# EAGLE design GSMGPSShield (EAGLE 6.3)
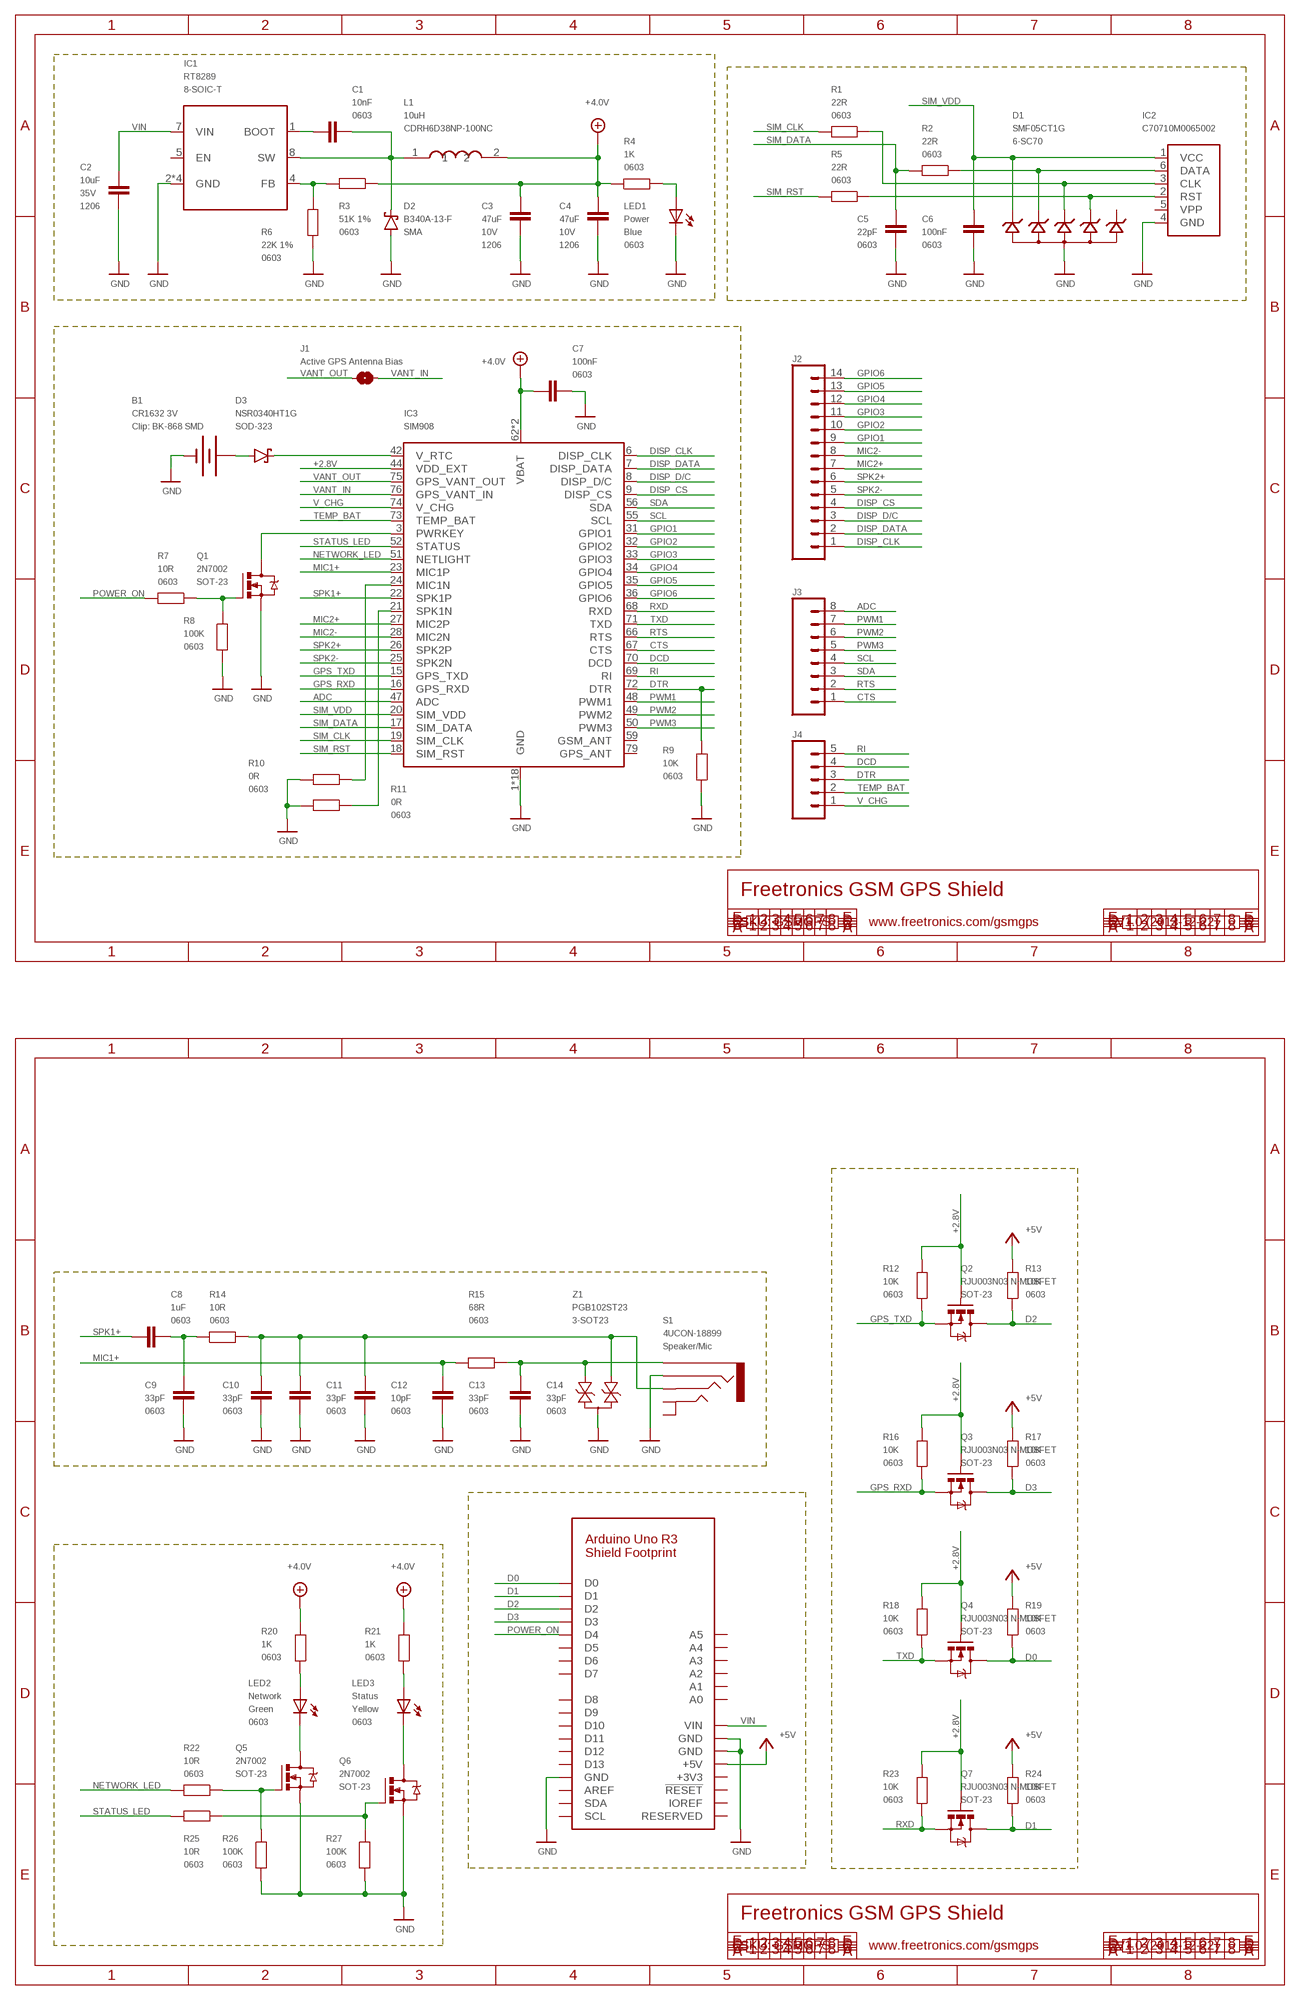
[diagram p0: schematic, sheet 1]

## Parts
B1  CR1632 3V  BATTERY  [BATCON_16MM]
C1  10nF  CAP0603  [0603]
C2  10uF  C-EUC1206  [C1206]
C3  47uF  C-EUC1206  [C1206]
C4  47uF  C-EUC1206  [C1206]
C5  22pF  CAP0603  [0603]
C6  100nF  CAP0603  [0603]
C7  100nF  CAP0603  [0603]
C8  1uF  CAP0603  [0603]
C9  33pF  CAP0603  [0603]
C10  33pF  CAP0603  [0603]
C11  33pF  CAP0603  [0603]
C12  10pF  CAP0603  [0603]
C13  33pF  CAP0603  [0603]
C14  33pF  CAP0603  [0603]
D1  SMF05CT1G  [SC70-6]
D2  B340A-13-F  SCHOTTKY-SMA  [SMA]
D3  NSR0340HT1G  SCHOTTKY-SOD323  [SOD-323]
IC1  RT8289  [SO08T]
IC2  C70710M0065002  [C70710M0065002]
IC3  SIM908  [SIM908]
J1  Active GPS Antenna Bias  SJ  [SJ]
J2  M14  [1X14]
J3  M08STD  [1X08]
J4  M05PTH  [1X05]
J5  ARDUINO-SHIELD_R3_NOISP  [ARDUINO-SHIELD_R3_NOISP]
L1  10uH  CDRH6D38SMT  [CDRH]
LED1  Power  LED0603  [LED-0603]
LED2  Network  LED0603  [LED-0603]
LED3  Status  LED0603  [LED-0603]
Q1  2N7002  [SOT23-3]
Q2  RJU003N03 N-MOSFET  MOSFET-NSOT-323  [SOT32-3]
Q3  RJU003N03 N-MOSFET  MOSFET-NSOT-323  [SOT32-3]
Q4  RJU003N03 N-MOSFET  MOSFET-NSOT-323  [SOT32-3]
Q5  2N7002  [SOT23-3]
Q6  2N7002  [SOT23-3]
Q7  RJU003N03 N-MOSFET  MOSFET-NSOT-323  [SOT32-3]
R1  22R  RESISTOR0603  [0603]
R2  22R  RESISTOR0603  [0603]
R3  51K 1%  RESISTOR0603  [0603]
R4  1K  RESISTOR0603  [0603]
R5  22R  RESISTOR0603  [0603]
R6  22K 1%  RESISTOR0603  [0603]
R7  10R  RESISTOR0603  [0603]
R8  100K  RESISTOR0603  [0603]
R9  10K  RESISTOR0603  [0603]
R10  0R  RESISTOR0603  [0603]
R11  0R  RESISTOR0603  [0603]
R12  10K  RESISTOR0603  [0603]
R13  10K  RESISTOR0603  [0603]
R14  10R  RESISTOR0603  [0603]
R15  68R  RESISTOR0603  [0603]
R16  10K  RESISTOR0603  [0603]
R17  10K  RESISTOR0603  [0603]
R18  10K  RESISTOR0603  [0603]
R19  10K  RESISTOR0603  [0603]
R20  1K  RESISTOR0603  [0603]
R21  1K  RESISTOR0603  [0603]
R22  10R  RESISTOR0603  [0603]
R23  10K  RESISTOR0603  [0603]
R24  10K  RESISTOR0603  [0603]
R25  10R  RESISTOR0603  [0603]
R26  100K  RESISTOR0603  [0603]
R27  100K  RESISTOR0603  [0603]
S1  4UCON-18899  AUDIO-JACK-4POLE  [4UCON-18899]
Z1  PGB102ST23  [SOT23-3]

## Nets
+2.8V: IC3.44(VDD_EXT) Q2.1(G) Q3.1(G) Q4.1(G) Q7.1(G) R12.1 R16.1 R18.1 R23.1
+4.0V: C3.1 C4.1 C7.2 IC3.62(VBAT) IC3.63(VBAT) L1.2 R3.1 R4.1 R20.1 R21.1
+5V: J5.+5V R13.1 R17.1 R19.1 R24.1
ADC: IC3.47(ADC) J3.8
CTS: IC3.67(CTS) J3.1
D0: J5.D0 Q4.3(D) R19.2
D1: J5.D1 Q7.3(D) R24.2
D2: J5.D2 Q2.3(D) R13.2
D3: J5.D3 Q3.3(D) R17.2
DCD: IC3.70(DCD) J4.4
DISP_CLK: IC3.6(DISP_CLK) J2.1
DISP_CS: IC3.9(DISP_CS) J2.4
DISP_D/C: IC3.8(DISP_D/C) J2.3
DISP_DATA: IC3.7(DISP_DATA) J2.2
DTR: IC3.72(DTR) J4.3 R9.1
GND: B1.GND(-) C2.2 C3.2 C4.2 C5.1 C6.1 C7.1 C9.1 C10.1 C11.1 C12.1 C13.1 C14.1 D1.2(A2) D2.A IC1.2(GND) IC1.3(GND) IC1.6(GND) IC1.PAD(GND) IC2.4(GND) IC3.1(GND) IC3.2(GND) IC3.5(GND) IC3.10(GND) IC3.14(GND) IC3.37(GND) IC3.40(GND) IC3.41(GND) IC3.43(GND) IC3.57(GND) IC3.58(GND) IC3.60(GND) IC3.61(GND) IC3.64(GND) IC3.65(GND) IC3.77(GND) IC3.78(GND) IC3.80(GND) J5.GND J5.GND@0(GND) J5.GND@1(GND) LED1.C Q1.2(S) Q5.2(S) Q6.2(S) R6.1 R8.1 R9.2 R10.2 R11.2 R26.1 R27.1 S1.4 Z1.3
GPIO1: IC3.31(GPIO1) J2.9
GPIO2: IC3.32(GPIO2) J2.10
GPIO3: IC3.33(GPIO3) J2.11
GPIO4: IC3.34(GPIO4) J2.12
GPIO5: IC3.35(GPIO5) J2.13
GPIO6: IC3.36(GPIO6) J2.14
GPS_RXD: IC3.16(GPS_RXD) Q3.2(S) R16.2
GPS_TXD: IC3.15(GPS_TXD) Q2.2(S) R12.2
MIC1+: C13.2 IC3.23(MIC1P) R15.1
MIC2+: IC3.27(MIC2P) J2.7
MIC2-: IC3.28(MIC2N) J2.8
N$1: LED1.A R4.2
N$2: LED2.C Q5.3(D)
N$3: LED3.C Q6.3(D)
N$4: Q5.1(G) R22.1 R26.2
N$5: Q6.1(G) R25.1 R27.2
N$7: D3.K IC3.42(V_RTC)
N$8: IC3.3(PWRKEY) Q1.3(D)
N$9: B1.PWR@1(+) D3.A
N$10: IC3.21(SPK1N) R11.1
N$11: IC3.24(MIC1N) R10.1
N$12: D1.5(K5) IC2.2(RST) R5.1
N$13: D1.4(K4) IC2.3(CLK) R1.1
N$15: D1.3(K3) IC2.6(DATA) R2.1
N$16: C14.2 R15.2 S1.1 Z1.2
N$17: C10.2 C11.2 C12.2 R14.2 S1.3 Z1.1
N$20: C8.1 C9.2 R14.1
N$34: Q1.1(G) R7.1 R8.2
N$76: LED3.A R21.2
N$77: LED2.A R20.2
N$143: C1.1 D2.K IC1.8(SW) L1.1
N$144: IC1.4(FB) R3.2 R6.2
N$145: C1.2 IC1.1(BOOT)
NETWORK_LED: IC3.51(NETLIGHT) R22.2
POWER_ON: J5.D4 R7.2
PWM1: IC3.48(PWM1) J3.7
PWM2: IC3.49(PWM2) J3.6
PWM3: IC3.50(PWM3) J3.5
RI: IC3.69(RI) J4.5
RTS: IC3.66(RTS) J3.2
RXD: IC3.68(RXD) Q7.2(S) R23.2
SCL: IC3.55(SCL) J3.4
SDA: IC3.56(SDA) J3.3
SIM_CLK: IC3.19(SIM_CLK) R1.2
SIM_DATA: C5.2 IC3.17(SIM_DATA) R2.2
SIM_RST: IC3.18(SIM_RST) R5.2
SIM_VDD: C6.2 D1.1(K1) IC2.1(VCC) IC3.20(SIM_VDD)
SPK1+: C8.2 IC3.22(SPK1P)
SPK2+: IC3.26(SPK2P) J2.6
SPK2-: IC3.25(SPK2N) J2.5
STATUS_LED: IC3.52(STATUS) R25.2
TEMP_BAT: IC3.73(TEMP_BAT) J4.2
TXD: IC3.71(TXD) Q4.2(S) R18.2
V_CHG: IC3.74(V_CHG) J4.1
VANT_IN: IC3.76(GPS_VANT_IN) J1.2
VANT_OUT: IC3.75(GPS_VANT_OUT) J1.1
VIN: C2.1 IC1.7(VIN) J5.VIN
Unconnected: D1.6(K6) IC1.5(EN) IC2.5(VPP) IC3.59(GSM_ANT) IC3.79(GPS_ANT) J5.!RESET J5.A0 J5.A1 J5.A2 J5.A3 J5.A4 J5.A5 J5.AREF J5.D5 J5.D6 J5.D7 J5.D8 J5.D9 J5.D10 J5.D11 J5.D12 J5.D13 J5.IOREF J5.RESERVED J5.SCL J5.SDA S1.2A S1.2B

## Notes on the sheet
- Freetronics GSM GPS Shield
- SKU: GSMGPS | www.freetronics.com/gsmgps | V1.0 (2013-12-22)
- Freetronics GSM GPS Shield
- SKU: GSMGPS | www.freetronics.com/gsmgps | V1.0 (2013-12-22)

## Power pins joined to a net without a drawn wire
+3V3: J5.3V3(+3V3)

## Library data of the parts
B1 = freetronics-master-v1:BATTERY: Battery Holders Various common sizes : AA, AAA, 20mm coin cell and 12mm coin cell.; FOO: Clip: BK-868 SMD
C1 C5-C14 = freetronics-master-v1:CAP: Capacitor Standard 0603 ceramic capacitor, and 0.1" leaded capacitor.; PACKAGE: 0603
C2 = rcl:C-EU: CAPACITOR, European symbol; PACKAGE: 1206; VOLTAGE: 35V
C3 C4 = rcl:C-EU: CAPACITOR, European symbol; PACKAGE: 1206; VOLTAGE: 10V
D1 = freetronics-luke:SMF05CT1G: SMF05CT1G 5-way transient voltage suppressor array; PACKAGE: 6-SC70
D2 = freetronics-luke:SCHOTTKY: Schottky diode; PACKAGE: SMA
D3 = freetronics-luke:SCHOTTKY: Schottky diode; PACKAGE: SOD-323
IC1 = freetronics-luke:RT8289: RT8289 buck regulator; PACKAGE: 8-SOIC-T
IC2 = freetronics-luke:C70710M0065002: Amphenol C70710M0065002 6-pin SIM socket
IC3 = freetronics-luke:SIM908: SIM908 GPRS/GPS Module
J1 = freetronics-luke:SJ: PCB "solder jumper". Note that there should nothing on the BOM corresponding to this "component".
J2 = freetronics-master-v1:M14: Header 14 Standard 14-pin 0.1" header. Use with straight break away headers (SKU : PRT-00116), right angle break away headers (PRT-00553), swiss pins (PRT-00743), machine pins (PRT-00117), and female headers (PRT-00115).
J3 = freetronics-master-v1:M08: Header 8 Standard 8-pin 0.1" header. Use with straight break away headers (SKU : PRT-00116), right angle break away headers (PRT-00553), swiss pins (PRT-00743), machine pins (PRT-00117), and female headers (PRT-00115).
J4 = freetronics-master-v1:M05: Header 5 Standard 5-pin 0.1" header. Use with straight break away headers (SKU : PRT-00116), right angle break away headers (PRT-00553), swiss pins (PRT-00743), machine pins (PRT-00117), and female headers (PRT-00115). Molex polarized connector foot print use with SKU : PRT-08230 with associated crimp pins and housings.
J5 = freetronics-luke:ARDUINO-SHIELD_R3_NOISP
L1 = freetronics-jon:CDRH6D38: Inductor; ID: CDRH6D38NP-100NC
LED1 = freetronics-master-v1:LED: LEDs Standard schematic elements and footprints for 5mm, 3mm, 1206, and 0603 sized LEDs. 5mm - Spark Fun Electronics SKU : COM-00529 (and others); COLOR: Blue; PACKAGE: 0603
LED2 = freetronics-master-v1:LED: LEDs Standard schematic elements and footprints for 5mm, 3mm, 1206, and 0603 sized LEDs. 5mm - Spark Fun Electronics SKU : COM-00529 (and others); COLOR: Green; PACKAGE: 0603
LED3 = freetronics-master-v1:LED: LEDs Standard schematic elements and footprints for 5mm, 3mm, 1206, and 0603 sized LEDs. 5mm - Spark Fun Electronics SKU : COM-00529 (and others); COLOR: Yellow; PACKAGE: 0603
Q1 Q5 Q6 = freetronics-luke:2N7002: 2N7002 N-ch MOSFET in SOT-23.; PACKAGE: SOT-23
Q2-Q4 Q7 = freetronics-jon:MOSFET-N: Basic N-Channel MOSFET; PACKAGE: SOT-23
R1-R27 = freetronics-master-v1:RESISTOR: Resistor Basic schematic elements and footprints for 0603, 1206, and PTH 1/10th watt (small) resistors.; PACKAGE: 0603
S1 = freetronics-jon:AUDIO-JACK-4POLE; FOO: Speaker/Mic
Z1 = freetronics-luke:PGB102ST23: Littelfuse PGB1 ESD transient suppressor in dual SOT-23 package. http://www.littelfuse.com/data/en/Data_Sheets/Littelfuse_PulseGuard-ESD_PGB1.pdf; PACKAGE: 3-SOT23

## Board
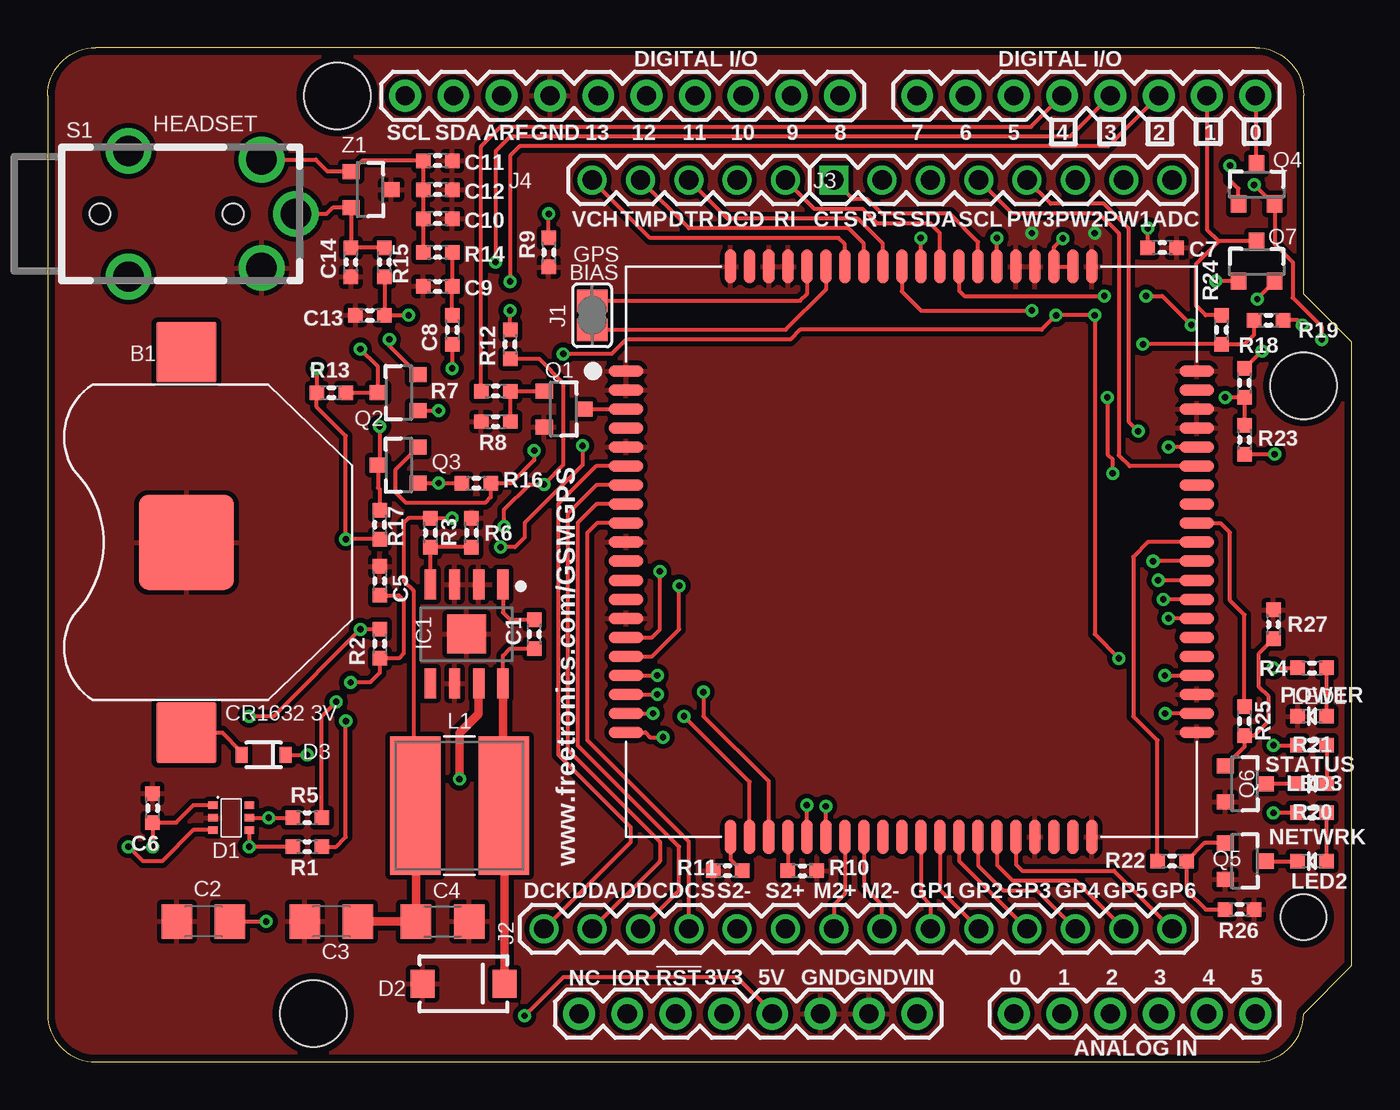
[diagram p1: board, top side]
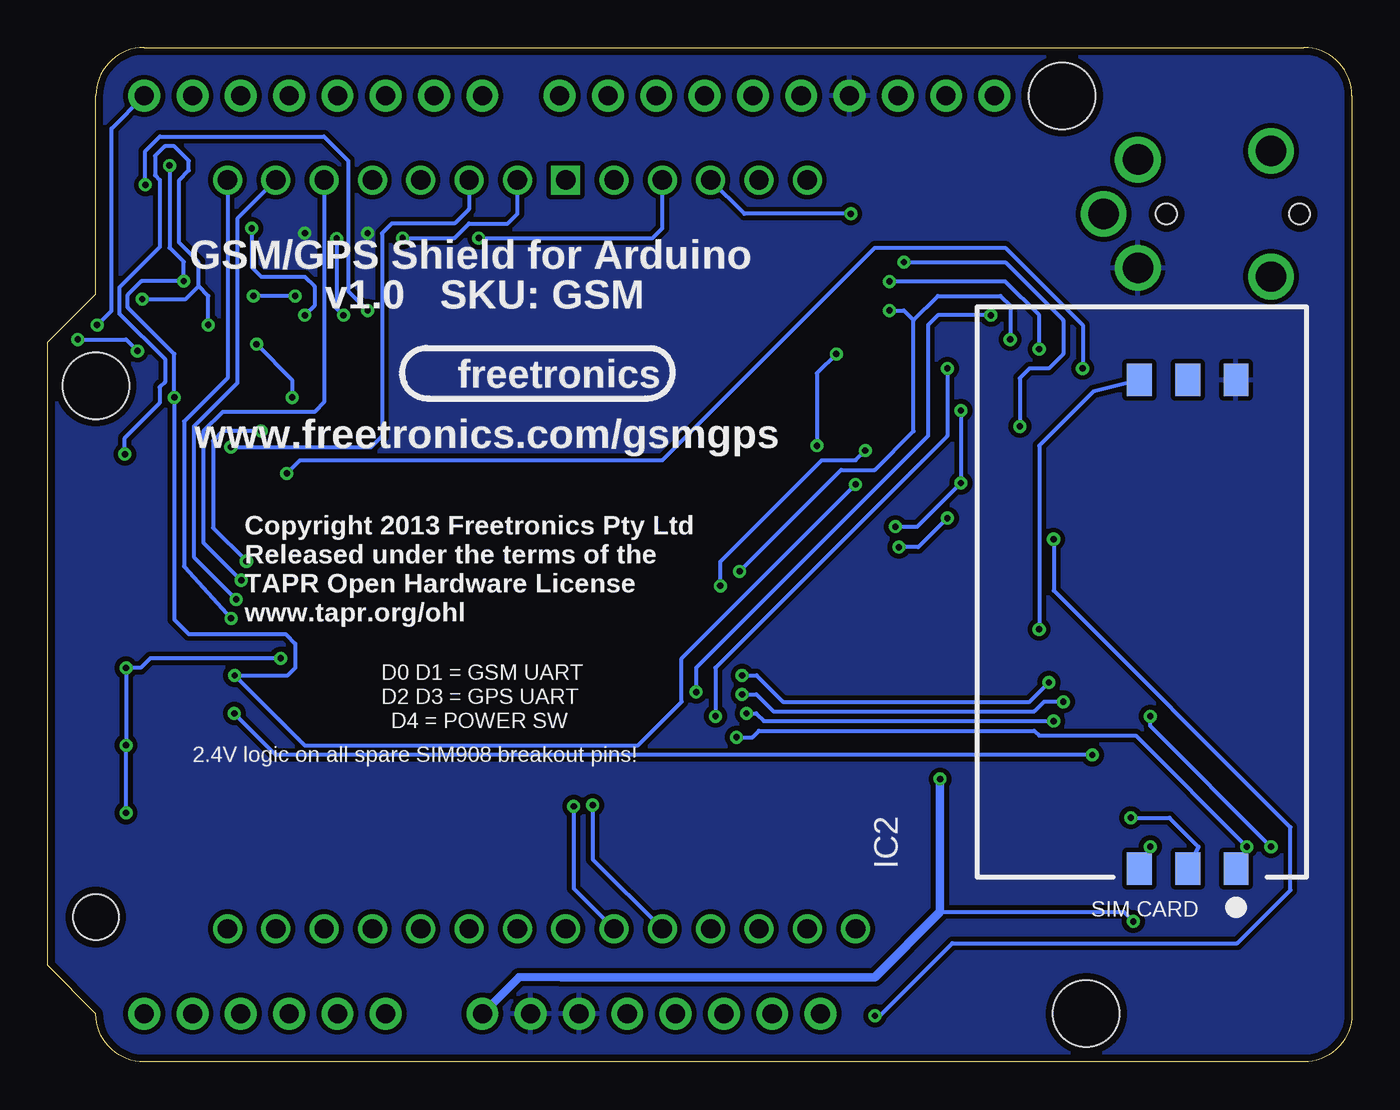
[diagram p2: board, bottom side, seen from below]

Size 68.58 x 53.34 mm. Coordinates in mm from the lower left corner, seen from the top.
Copper layers (1*16): Top 0.0356mm / dielectric 1.5011mm / Bottom 0.0356mm
Design rules "LaenPCBOrder *": minimum track width 6mil, minimum drill 13mil, track to track 6mil, track to pad 6mil, pad to pad 6mil, via to via 6mil, smd to smd 6mil, copper to edge 15mil, drill to drill 6mil, minimum pad ring 7mil, minimum via ring 7mil, stop-mask expansion 4mil, vias tented up to drill 14mil, thermal gap 10mil

### Footprints (pad centres in the part's own frame; a part is rotated, then mirrored left to right if it is on the bottom)
BATCON_16MM = smd 5 x 5: GND 0,0 | smd 3.175 x 3.175: PWR@1 -10,0; PWR@2 10,0
0603 = smd 0.762 x 0.762: 1 -0.762,0; 2 0.762,0
C1206 = smd 1.6 x 1.8: 1 -1.4,0; 2 1.4,0
SC70-6 = smd 0.4 x 0.5: 1 -0.65,-0.95; 2 0,-0.95; 3 0.65,-0.95; 4 0.65,0.95; 5 0,0.95; 6 -0.65,0.95
SMA = smd 1.27 x 1.47: A -2.15,0; K 2.15,0
SOD-323 = smd 0.63 x 0.83: A 1.15,0; K -1.15,0
SO08T = smd 0.6 x 1.575: 1 -1.905,-2.6; 2 -0.635,-2.6; 3 0.635,-2.6; 4 1.905,-2.6; 5 1.905,2.6; 6 0.635,2.6; 7 -0.635,2.6; 8 -1.905,2.6 | smd 2.057 x 2.057: PAD 0,0
C70710M0065002 = smd 1.7 x 1.3: 1 0,-2.54; 2 0,0; 3 0,2.54; 4 25.7,-2.54; 5 25.7,0; 6 25.7,2.54
SIM908 = smd 1.8 x 0.6: 1 0,24.5; 2 0,23.5; 3 0,22.5; 4 0,21.5; 5 0,20.5; 6 0,19.5; 7 0,18.5; 8 0,17.5; 9 0,16.5; 10 0,15.5; 11 0,14.5; 12 0,13.5; 13 0,12.5; 14 0,11.5; 15 0,10.5; 16 0,9.5; 17 0,8.5; 18 0,7.5; 19 0,6.5; 20 0,5.5; 41 30,5.5; 42 30,6.5; 43 30,7.5; 44 30,8.5; 45 30,9.5; 46 30,10.5; 47 30,11.5; 48 30,12.5; 49 30,13.5; 50 30,14.5; 51 30,15.5; 52 30,16.5; 53 30,17.5; 54 30,18.5; 55 30,19.5; 56 30,20.5; 57 30,21.5; 58 30,22.5; 59 30,23.5; 60 30,24.5 | smd 0.6 x 1.8: 21 5.5,0; 22 6.5,0; 23 7.5,0; 24 8.5,0; 25 9.5,0; 26 10.5,0; 27 11.5,0; 28 12.5,0; 29 13.5,0; 30 14.5,0; 31 15.5,0; 32 16.5,0; 33 17.5,0; 34 18.5,0; 35 19.5,0; 36 20.5,0; 37 21.5,0; 38 22.5,0; 39 23.5,0; 40 24.5,0; 61 24.5,30; 62 23.5,30; 63 22.5,30; 64 21.5,30; 65 20.5,30; 66 19.5,30; 67 18.5,30; 68 17.5,30; 69 16.5,30; 70 15.5,30; 71 14.5,30; 72 13.5,30; 73 12.5,30; 74 11.5,30; 75 10.5,30; 76 9.5,30; 77 8.5,30; 78 7.5,30; 79 6.5,30; 80 5.5,30
SJ = smd 1.168 x 1.6: 1 -0.762,0; 2 0.762,0
1X14 = drill 1.016: 1 0,0; 2 2.54,0; 3 5.08,0; 4 7.62,0; 5 10.16,0; 6 12.7,0; 7 15.24,0; 8 17.78,0; 9 20.32,0; 10 22.86,0; 11 25.4,0; 12 27.94,0; 13 30.48,0; 14 33.02,0
1X08 = drill 1.016 square: 1 0,0 | drill 1.016: 2 2.54,0; 3 5.08,0; 4 7.62,0; 5 10.16,0; 6 12.7,0; 7 15.24,0; 8 17.78,0
1X05 = drill 1.016: 1 0,0; 2 2.54,0; 3 5.08,0; 4 7.62,0; 5 10.16,0
ARDUINO-SHIELD_R3_NOISP = drill 1 pad 1.676: 3V3 2.54,-24.13; !RESET 0,-24.13; +5V 5.08,-24.13; A0 17.78,-24.13; A1 20.32,-24.13; A2 22.86,-24.13; A3 25.4,-24.13; A4 27.94,-24.13; A5 30.48,-24.13; AREF -9.144,24.13; D0 30.48,24.13; D1 27.94,24.13; D2 25.4,24.13; D3 22.86,24.13; D4 20.32,24.13; D5 17.78,24.13; D6 15.24,24.13; D7 12.7,24.13; D8 8.636,24.13; D9 6.096,24.13; D10 3.556,24.13; D11 1.016,24.13; D12 -1.524,24.13; D13 -4.064,24.13; GND 10.16,-24.13; GND@0 7.62,-24.13; GND@1 -6.604,24.13; IOREF -2.54,-24.13; RESERVED -5.08,-24.13; SCL -14.224,24.13; SDA -11.684,24.13; VIN 12.7,-24.13 | hole 3.5: 33.02,8.89; -17.78,24.13; -19.05,-24.13 | hole 2.4: 33.02,-19.05
CDRH = smd 7.3 x 2.65: 1 0,2.325; 2 0,-2.325
LED-0603 = smd 0.762 x 0.762: A -0.762,0; C 0.762,0
SOT23-3 = smd 0.8 x 0.9: 1 -0.95,-1; 2 0.95,-1; 3 0,1.1
4UCON-18899 = drill 1.6: 1 8.8,0; 2A 0,3.3; 2B 0,-3.3; 3 7,2.85; 4 7,-2.85 | hole 1.1: -1.5,0; 5.5,0

### Placement (x,y rotation side)
B1  7.3,27.32 90 top
C1  25.59,22.5 90 top
C2  8.19,7.39 180 top
C3  14.92,7.39 180 top
C4  20.76,7.39 0 top
C5  17.46,25.29 270 top
C6  5.52,13.35 270 top
C7  58.61,42.82 180 top
C8  21.27,38.5 270 top
C9  20.51,40.79 0 top
C10  20.51,44.34 180 top
C11  20.51,47.39 180 top
C12  20.51,45.87 180 top
C13  16.95,39.26 0 top
C14  15.95,42.06 90 top
D1  9.65,12.85 270 top
D2  21.87,4.11 0 top
D3  11.37,16.15 180 top
IC1  22.03,22.5 180 top
IC2  8.63,10.16 90 bottom
IC3  30.42,11.83 0 top
J1  28.64,39.26 90 top
J2  26.1,7 0 top
J3  41.34,46.37 0 top
J4  28.64,46.37 0 top
J5  33.02,26.67 0 top
L1  21.65,13.48 270 top
LED1  66.48,18.18 180 top
LED2  66.48,10.56 180 top
LED3  66.48,14.62 180 top
Q1  27.11,34.33 270 top
Q2  2N7002  [SOT23-3]  18.48,35.2 90 top
Q3  2N7002  [SOT23-3]  18.48,31.39 90 top
Q4  2N7002  [SOT23-3]  63.56,46.12 0 top
Q5  62.93,10.56 270 top
Q6  62.93,14.62 270 top
Q7  2N7002  [SOT23-3]  63.56,42.06 0 top
R1  13.65,11.32 0 top
R2  17.46,21.99 270 top
R3  20.13,27.83 270 top
R4  66.48,20.72 0 top
R5  13.65,12.85 0 top
R6  22.29,27.83 270 top
R7  23.56,35.27 180 top
R8  23.56,33.67 0 top
R9  26.35,42.56 270 top
R10  39.69,10.05 0 top
R11  35.75,10.05 180 top
R12  24.32,37.74 90 top
R13  14.92,35.2 0 top
R14  20.51,42.56 180 top
R15  17.72,42.06 90 top
R16  22.54,30.44 0 top
R17  17.46,28.25 90 top
R18  62.93,35.71 90 top
R19  64.2,39.01 0 top
R20  66.48,13.1 0 top
R21  66.48,16.66 0 top
R22  59.12,10.56 180 top
R23  62.93,32.72 270 top
R24  61.72,38.5 90 top
R25  62.93,17.93 90 top
R26  62.67,8.02 180 top
R27  64.45,23.01 270 top
S1  4.25,44.6 0 top
Z1  16.95,45.87 270 top

### Tracks (layer width: path | path; a pad name or v marks a point on that pad's centre or on a via)
+2.8V  (via drill 0.33)
  Top 0.203: 62.61,45.04 Q4.1 62.61,45.93 62.17,46.37 v62.17,47.14 | Q7.1 v61.42,41.06 | Q2.1 v20.56,34.25 | Q3.1 v20.56,30.44 R16.1 | R12.1 25.84,36.98 27.11,35.71 27.11,31.39 v26.1,30.37 25.34,30.37 24,29.04 v24,28.15 | R23.1 R18.1 v61.91,34.94 | v58.75,20.33 IC3.44
  Bottom 0.203: v62.17,47.14 62.17,42.82 61.42,42.07 v61.42,41.06 63.65,41.06 64.36,40.35 64.36,39.68 61.91,37.23 v61.91,34.94 61.91,23.26 61.15,22.5 56.07,22.5 55.56,21.99 55.56,20.72 55.95,20.33 v58.75,20.33 55.07,16.66 37.53,16.66 35.24,18.94 35.24,21.23 v26.1,30.37 | v20.56,34.25 v20.56,30.44 22.85,28.15 v24,28.15
+4.0V  (via drill 0.33)
  Top 0.203: L1.2 18.99,13.82 18.99,15.64 19.24,15.89 19.24,24.78 18.73,25.29 18.73,28.34 18.99,28.59 R3.1 v21.27,28.59 | R20.1 v64.45,13.1 | v64.45,16.66 R21.1 | 65.79,20.66 R4.1 v64.45,20.72 | IC3.62 IC3.63 52.92,42.84 v53.38,43.3 | C7.2 v57.85,43.83 | v56.32,21.23 55.05,22.5 v55.05,39.26 v53.02,39.26 52.26,38.5 39.56,38.5 39.05,37.99 30.42,37.99 29.65,37.23 v27.11,37.23 | v28.13,32.4 28.13,31.39 25.08,28.34 25.08,27.58 24.57,27.07 v23.81,27.07
  Top 0.457: L1.2 19.36,13.45 C4.1 C3.1
  Bottom 0.203: v64.45,13.1 v64.45,16.66 v64.45,20.72 63.69,20.72 63.18,21.23 v56.32,21.23 | v53.38,43.3 53.38,39.62 v53.02,39.26 | v57.85,43.83 57.85,41.8 57.34,41.29 55.05,41.29 54.55,40.79 54.55,39.77 v55.05,39.26 | v27.11,37.23 28.13,36.21 v28.13,32.4 | v21.27,28.59 22.8,27.07 v23.81,27.07
+5V  (via drill 0.33)
  Top 0.203: R17.1 v15.68,27.49 15.68,32.91 14.16,34.44 R13.1 v14.16,36.47 | R19.1 63.44,38.25 62.93,37.74 R24.1 v57.59,37.74 | v25.08,2.43 27.11,4.46 36.26,4.46 38.16,2.56 38.14,2.54 J5.+5V | v55.72,34.94 55.72,31.94 56,31.66 v56,30.95
  Bottom 0.203: v25.08,2.43 24.83,2.43 21.02,6.24 6.03,6.24 3.24,9.04 3.24,12.34 15.68,24.78 v15.68,27.49 | v57.59,37.74 55.72,35.87 v55.72,34.94 | v56,30.95 55.31,31.64 36.26,31.64 25.08,42.82 18.22,42.82 14.16,38.75 v14.16,36.47
ADC  (via drill 0.33)
  Top 0.203: IC3.47 v58.93,23.33
  Bottom 0.203: J3.8 59.12,35.96 61.4,33.67 61.4,26.05 v58.93,23.33
CTS
  Top 0.203: IC3.67 48.92,43.11 47.43,44.6 43.88,44.6 43.12,45.36 42.35,45.36 J3.1
D0  (via drill 0.33)
  Top 0.203: v65.98,38.75 65.72,39.01 R19.2 | Q4.3 63.56,50.74 J5.D0
  Bottom 0.203: v65.98,38.75 65.21,39.52 65.21,49.09 J5.D0
D1
  Top 0.203: Q7.3 61.57,43.16 | R24.2 60.9,39.26 60.39,39.77 60.39,41.97 61.57,43.16 | J5.D1 60.96,43.77 61.57,43.16
D2  (via drill 0.33)
  Top 0.203: R13.2 Q2.3 17.38,36.55 v16.45,37.48 | v24.32,41.04 24.32,47.64 24.83,48.15 55.77,48.15 J5.D2
  Bottom 0.203: v16.45,37.48 16.45,39.26 18.22,41.04 v24.32,41.04
D3  (via drill 0.33)
  Top 0.203: R17.2 17.46,30.12 17.38,30.2 Q3.3 17.46,31.47 v17.46,33.42 | v23.56,42.06 23.56,47.9 24.32,48.66 53.74,48.66 J5.D3
  Bottom 0.203: v23.56,42.06 18.22,42.06 15.18,39.01 15.18,37.23 15.94,36.47 16.95,36.47 17.46,35.96 v17.46,33.42
DCD  (via drill 0.33)
  Top 0.203: IC3.70 v45.92,43.32 v45.91,43.33
  Bottom 0.203: v45.91,43.33 36.77,43.33 36.26,43.83 J4.4
DISP_CLK
  Top 0.203: J2.1 30.67,11.58 30.67,12.34 26.86,16.15 26.86,29.36 28.83,31.33 IC3.6
DISP_CS
  Top 0.203: J2.4 33.72,11.58 28.38,16.91 28.38,27.83 28.88,28.33 IC3.9
DISP_D/C
  Top 0.203: J2.3 33.21,9.04 33.21,11.32 27.88,16.66 27.88,28.34 28.87,29.33 IC3.8
DISP_DATA
  Top 0.203: J2.2 32.19,10.56 32.19,11.58 27.37,16.4 27.37,28.85 28.85,30.33 IC3.7
DTR  (via drill 0.33)
  Top 0.203: IC3.72 43.92,43.03 42.61,44.34 35.75,44.34 J4.3 | R9.1 v26.35,44.6
  Bottom 0.203: v26.35,44.6 31.94,44.6 J4.3
GND  (via drill 0.33)
  other vias: 51.75,43.58 55.05,43.58
  pour Top (isolate 0.254): 0,53.34 68.58,53.34 68.58,0 0.01,0.01
  pour Bottom (isolate 0.254): 0,53.34 68.58,53.34 68.58,0 0,0
GPIO1
  Top 0.203: IC3.31 45.92,8.78 46.42,8.27 J2.9
GPIO2
  Top 0.203: IC3.32 46.92,9.05 J2.10
GPIO3
  Top 0.203: IC3.33 47.92,10.59 J2.11
GPIO4
  Top 0.203: IC3.34 48.92,10.35 50.23,9.04 52.01,9.04 J2.12
GPIO5
  Top 0.203: IC3.35 49.92,10.36 50.74,9.54 54.04,9.54 J2.13
GPIO6
  Top 0.203: IC3.36 50.92,10.38 51.24,10.05 56.07,10.05 J2.14
GPS_RXD  (via drill 0.33)
  Top 0.203: Q3.2 18.3,31.16 18.3,29.95 18.86,29.4 23,29.4 23.3,29.71 R16.2 24.39,30.44 25.59,31.64 v25.59,32.15 | IC3.16 31.79,21.33 33.21,22.75 v33.21,25.04
  Bottom 0.203: v33.21,25.04 33.21,26.31 27.88,31.64 26.1,31.64 v25.59,32.15
GPS_TXD  (via drill 0.33)
  Top 0.203: IC3.15 31.77,22.33 32.19,22.75 v32.19,25.8 | v17.97,37.99 17.97,37.66 Q2.2 | R12.2 v24.32,39.52
  Bottom 0.203: v32.19,25.8 26.86,31.13 25.08,31.13 23.05,33.17 23.05,39.01 | 23.05,39.01 21.78,40.28 18.48,40.28 17.97,39.77 v17.97,37.99 | v24.32,39.52 23.56,39.52 23.05,39.01
MIC1+  (via drill 0.33)
  Top 0.203: R15.1 C13.2 v18.99,39.26 | v34.48,19.45 34.48,18.18 37.92,14.74 IC3.23
  Bottom 0.203: v18.99,39.26 21.78,39.26 22.29,38.75 22.29,32.91 34.48,20.72 v34.48,19.45
MIC2+
  Top 0.203: IC3.27 41.92,8.85 41.34,8.27 J2.7
MIC2-
  Top 0.203: IC3.28 42.92,9.24 43.88,8.27 J2.8
N$1
  Top 0.203: LED1.A R4.2
N$2
  Top 0.203: Q5.3 LED2.C
N$3
  Top 0.203: LED3.C Q6.3
N$4
  Top 0.203: Q5.1 60.83,11.51 R22.1 59.88,9.04 60.9,8.02 R26.2
N$5
  Top 0.203: Q6.1 62.93,16.57 R25.1 63.44,17.16 64.2,17.93 64.2,19.22 63.69,19.73 63.69,21.48 R27.2
N$7  (via drill 0.33)
  Top 0.203: D3.K v13.65,16.15 | IC3.42 v58.76,18.33
  Bottom 0.203: v13.65,16.15 56.58,16.15 v58.76,18.33
N$8
  Top 0.203: Q1.3 IC3.3
N$9
  Top 0.203: D3.A 10.22,16.28 9.17,17.32 B1.PWR@1
N$10
  Top 0.203: IC3.21 35.92,10.65 R11.1
N$11
  Top 0.203: IC3.24 38.92,10.06 R10.1
N$12  (via drill 0.33)
  Top 0.203: D1.5 v11.62,12.85 R5.1
  Bottom 0.203: v11.62,12.85 9.59,12.85 8.06,11.32 IC2.2
N$13  (via drill 0.33)
  Top 0.203: D1.4 v10.6,11.32 R1.1
  Bottom 0.203: v10.6,11.32 IC2.3
N$15  (via drill 0.33)
  Top 0.203: D1.3 7.67,12.2 6.03,10.56 5.02,10.56 v4.25,11.32 | R2.1 v16.45,22.75 11.87,18.18 v10.6,18.18
  Bottom 0.203: v10.6,18.18 10.6,17.67 v4.25,11.32 | IC2.6 13.61,35.24 16.45,32.4 v16.45,22.75
N$16
  Top 0.203: S1.1 14.67,44.6 14.99,44.92 Z1.2 C14.2 R15.2
N$17
  Top 0.203: S1.3 14.1,47.45 14.73,46.82 Z1.1 16.53,47.39 C11.2 C12.2 C10.2 R14.2
N$20
  Top 0.203: R14.1 C9.2 C8.1
N$34
  Top 0.203: Q1.1 R7.1 R8.2
N$76
  Top 0.203: R21.2 LED3.A
N$77
  Top 0.203: LED2.A R20.2
N$143
  Top 0.203: IC1.8 23.94,21.36 24.32,21.74 C1.1
  Top 0.457: IC1.8 23.94,14.24 24.07,14.12 24.07,13.57 L1.1 24.02,13.44 D2.K
N$144
  Top 0.203: R6.2 R3.2 IC1.4
N$145
  Top 0.203: IC1.1 23.94,23.64 24.32,23.26 C1.2
NETWORK_LED
  Top 0.203: R22.2 58.36,16.91 57.09,18.18 57.09,26.56 57.85,27.33 IC3.51
POWER_ON
  Top 0.203: R7.2 22.8,48.15 23.81,49.17 51.71,49.17 J5.D4
PWM1  (via drill 0.33)
  Top 0.203: IC3.48 v58.66,24.33
  Bottom 0.203: v58.66,24.33 60.9,26.56 60.9,33.42 58.61,35.71 58.61,44.34 J3.7
PWM2  (via drill 0.33)
  Top 0.203: IC3.49 v58.39,25.33
  Bottom 0.203: J3.6 54.04,34.69 54.55,34.18 59.37,34.18 60.39,33.17 60.39,27.32 v58.39,25.33
PWM3  (via drill 0.33)
  Top 0.203: v57.34,33.17 56.83,33.67 56.83,43.83 55.54,45.13 52.75,45.13 J3.5 | IC3.50 v58.12,26.33
  Bottom 0.203: v57.34,33.17 59.37,33.17 59.88,32.66 59.88,28.09 v58.12,26.33
RI
  Top 0.203: IC3.69 46.92,43.59 46.42,44.09 43.62,44.09 42.86,44.85 40.32,44.85 J4.5
RTS  (via drill 0.33)
  Top 0.203: IC3.66 v49.92,43.33
  Bottom 0.203: J3.2 43.88,44.6 44.39,44.09 46.42,44.09 47.18,43.33 v49.92,43.33
RXD  (via drill 0.33)
  Top 0.203: IC3.68 47.92,40.56 48.2,40.28 v55.56,40.28 | v57.76,40.28 58.61,40.28 v60.13,38.75 | v63.6,40.12 64.43,40.97 Q7.2 | R23.2 v64.52,31.96
  Bottom 0.203: v55.56,40.28 v57.76,40.28 | v63.6,40.12 61.31,40.12 60.64,40.79 | 60.64,40.79 60.64,42.06 61.66,43.07 61.66,46.37 61.15,46.88 61.15,47.39 61.91,48.15 62.42,48.15 62.93,47.64 62.93,46.63 62.67,46.37 62.67,42.85 64.8,40.73 64.8,39.34 62.41,36.95 62.41,35.75 62.68,35.48 62.68,34.65 64.52,32.82 v64.52,31.96 | v60.13,38.75 60.13,40.28 60.64,40.79
SCL
  Top 0.203: IC3.55 56.89,31.33 56.32,31.9 56.32,43.58 55.29,44.62 50.71,44.62 J3.4
SDA  (via drill 0.33)
  Top 0.203: IC3.56 v58.94,32.33
  Bottom 0.203: J3.3 46.42,44.85 47.18,44.09 50.48,44.09 50.99,43.58 50.99,32.91 51.57,32.33 v58.94,32.33
SIM_CLK  (via drill 0.33)
  Top 0.203: IC3.19 v31.84,18.33 | R1.2 15.18,11.32 15.68,11.83 v15.68,17.93
  Bottom 0.203: v31.84,18.33 31.33,18.33 30.92,17.93 v15.68,17.93
SIM_DATA  (via drill 0.33)
  Top 0.203: IC3.17 v32.06,20.33 | v15.94,19.96 16.95,19.96 17.46,20.47 R2.2 18.48,21.23 18.73,21.48 18.73,24.28 18.48,24.53 C5.2
  Bottom 0.203: v32.06,20.33 31.3,20.33 29.91,18.94 16.95,18.94 v15.94,19.96
SIM_RST  (via drill 0.33)
  Top 0.203: IC3.18 v32.06,19.33 | R5.2 14.41,18.18 v15.18,18.94
  Bottom 0.203: v32.06,19.33 31.31,19.33 30.42,18.43 16.7,18.43 16.19,18.94 v15.18,18.94
SIM_VDD  (via drill 0.33)
  Top 0.203: v5.52,11.32 C6.2 6.76,12.59 7.67,13.5 D1.1 | IC3.20 31.43,17.33 31.69,17.08 v32.36,17.08
  Bottom 0.203: IC2.1 v5.52,11.32 11.37,17.16 16.45,17.16 16.7,17.42 31.18,17.42 31.52,17.08 v32.36,17.08
SPK1+  (via drill 0.33)
  Top 0.203: C8.2 v21.27,36.47 | IC3.22 36.92,14.73 v33.46,18.18
  Bottom 0.203: v21.27,36.47 21.27,32.91 33.46,20.72 v33.46,18.18
SPK2+  (via drill 0.33)
  Top 0.203: IC3.26 v40.92,13.44
  Bottom 0.203: v40.92,13.44 40.92,9.12 J2.6
SPK2-  (via drill 0.33)
  Top 0.203: IC3.25 v39.92,13.51
  Bottom 0.203: v39.92,13.51 39.92,10.66 J2.5
STATUS_LED
  Top 0.203: R25.2 62.93,23.51 62.17,24.28 62.17,27.83 61.67,28.33 IC3.52
TEMP_BAT
  Top 0.203: IC3.73 42.92,43.02 42.1,43.83 33.72,43.83 J4.2
TXD  (via drill 0.33)
  Top 0.203: v63.44,46.12 64.44,45.12 Q4.2 64.51,43.01 65.47,42.06 65.47,40.19 66.99,38.66 v66.99,37.99 | IC3.71 44.92,40.51 45.91,39.52 v51.75,39.52 | v63.85,37.39 R18.2
  Bottom 0.203: v63.44,46.12 63.44,47.9 62.67,48.66 54.04,48.66 52.77,47.39 52.77,40.53 v51.75,39.52 | v66.99,37.99 64.46,37.99 v63.85,37.39
V_CHG
  Top 0.203: IC3.74 41.92,43 41.59,43.33 31.69,43.33 J4.1
VANT_IN
  Top 0.203: IC3.76 39.92,40.38 39.56,40.02 J1.2
VANT_OUT
  Top 0.203: IC3.75 40.92,40.62 38.8,38.5 J1.1
VIN  (via drill 0.33)
  Top 0.203: C2.1 v11.49,7.39
  Top 0.457: IC1.7 22.67,18.31 21.65,17.29 v21.65,14.88
  Bottom 0.203: v11.49,7.39 12,7.89 21.65,7.89
  Bottom 0.432: 41.59,4.46 43.8,4.46 J5.VIN
  Bottom 0.457: 41.59,4.46 25.08,4.46 21.65,7.89 v21.65,14.88

### Text on the board
tPlace: HEADSET | VCH | TMP | DTR | DCD | RI | CTS | RTS | SDA | SCL | PW3 | PW2 | PW1 | ADC | GPS | BIAS | POWER | CR1632 3V | STATUS | NETWRK | www.freetronics.com/GSMGPS | DCK | DDA | DDC | DCS | S2- | S2+ | M2+ | M2- | GP1 | GP2 | GP3 | GP4 | GP5 | GP6
bPlace: GSM/GPS Shield for Arduino | v1.0 SKU: GSM | freetronics | www.freetronics.com/gsmgps | Copyright 2013 Freetronics Pty Ltd / Released under the terms of the / TAPR Open Hardware License / www.tapr.org/ohl | D0 D1 = GSM UART | D2 D3 = GPS UART | D4 = POWER SW | 2.4V logic on all spare SIM908 breakout pins! | SIM CARD
tNames: B1